# EAGLE design controller (EAGLE 7.2.0)
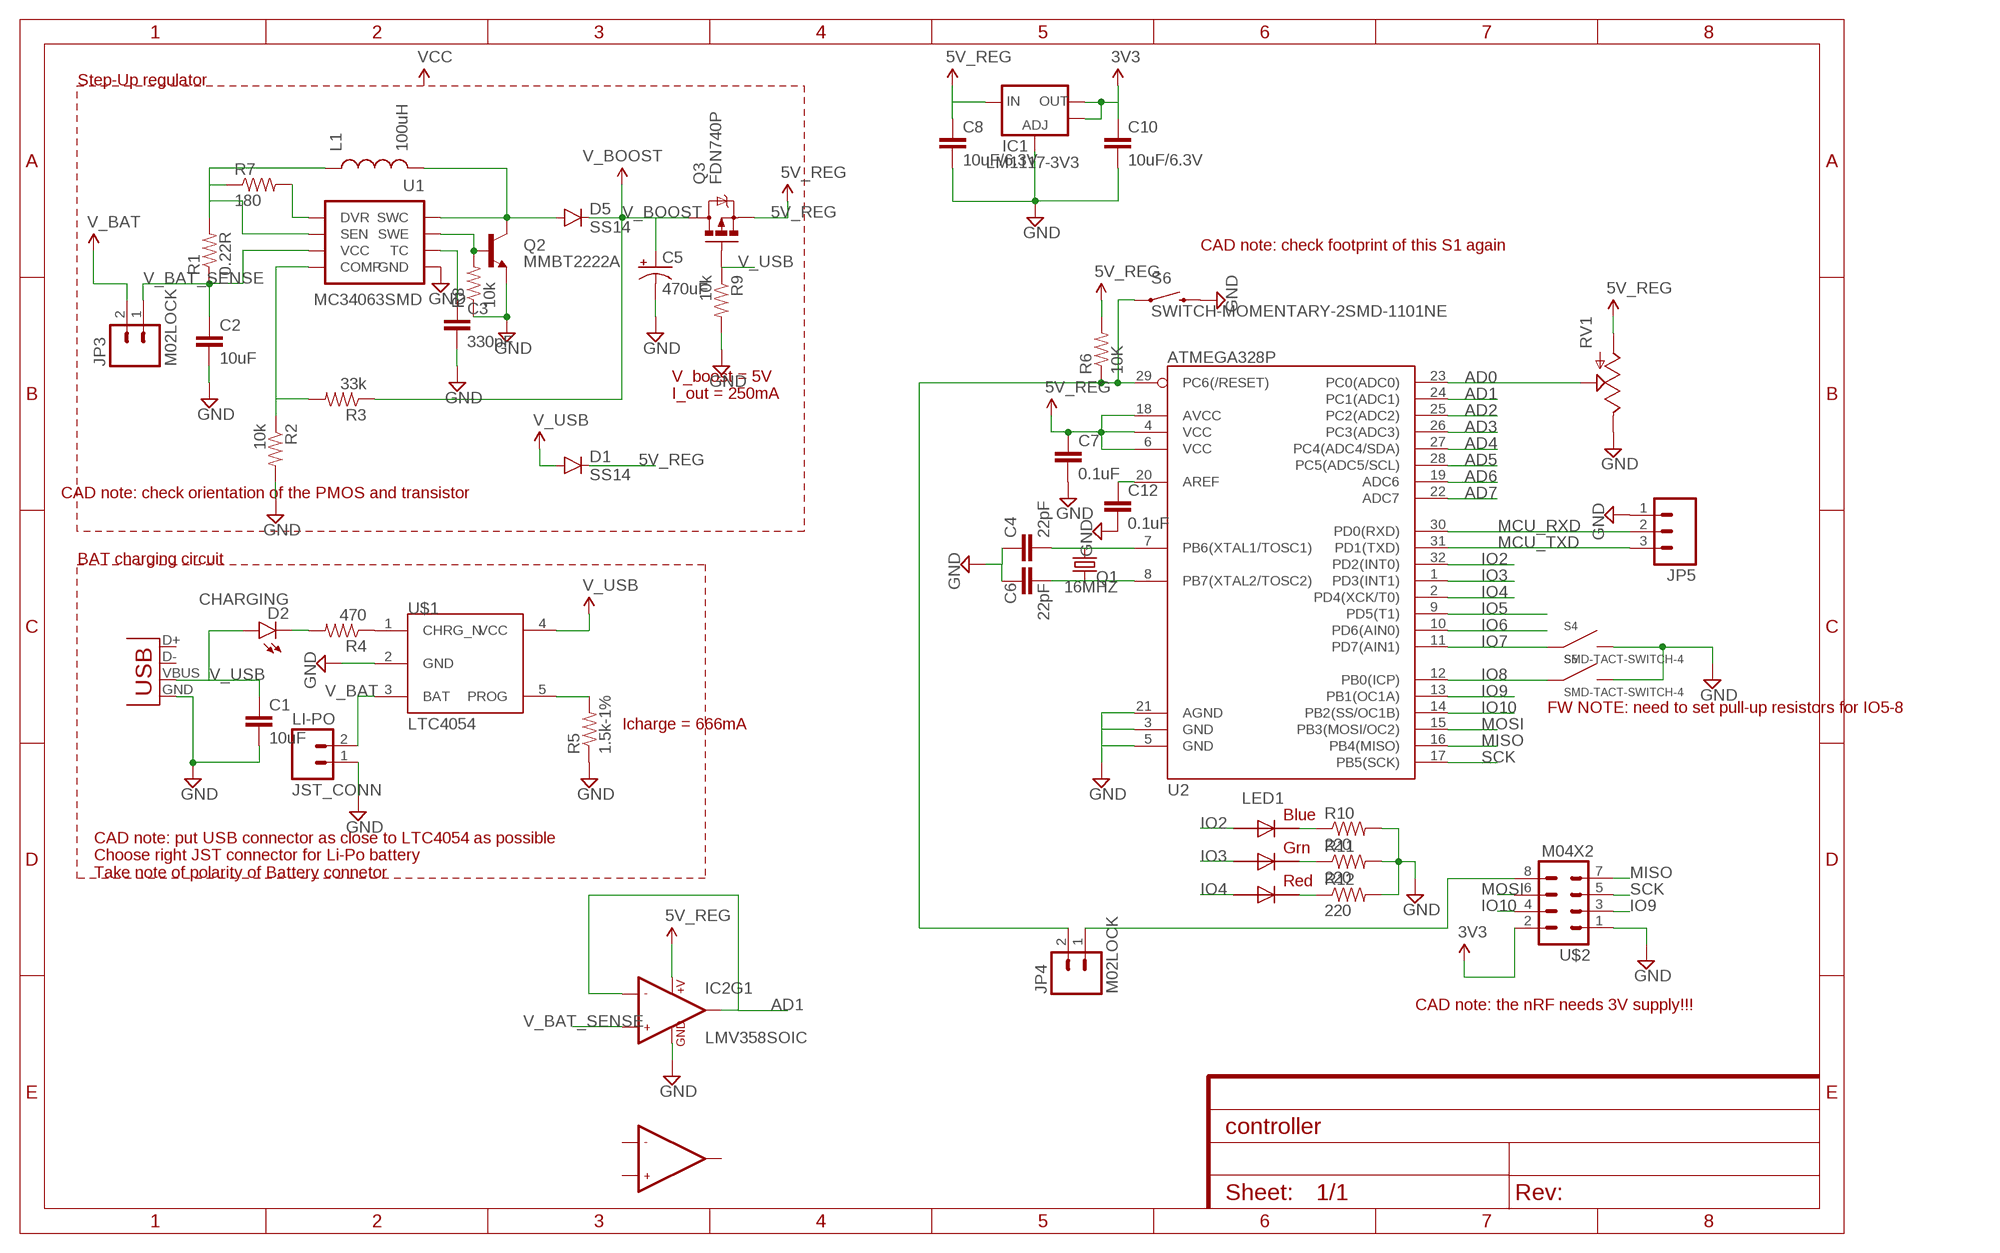
[diagram p0: schematic, sheet 1]

## Parts
C1  10uF  1.0UF-16V-10%(0603)  [0603-CAP]
C2  10uF  10UF-6.3V-20%(0603)  [0603-CAP]
C3  330pF  1.0UF-25V-+80/-20(0805)  [0805]
C4  22pF  22PF-50V-5%(0603)  [0603-CAP]
C5  470uF  100UF-10V-10%(TANT)  [EIA7343]
C6  22pF  22PF-50V-5%(0603)  [0603-CAP]
C7  0.1uF  0.1UF-25V(+80/-20%)(0603)  [0603-CAP]
C8  10uF/6.3V  10UF-6.3V-20%(0603)  [0603-CAP]
C10  10uF/6.3V  10UF-6.3V-20%(0603)  [0603-CAP]
C12  0.1uF  0.1UF-25V(+80/-20%)(0603)  [0603-CAP]
D1  SS14  DIODESMA-ALT  [SMA-DIODE_ALT]
D2  CHARGING  LED-GREEN0603  [LED-0603]
D5  SS14  DIODESMA-ALT  [SMA-DIODE_ALT]
IC1  LM1117-3V3  V_REG_LM1117SOT223  [SOT223]
IC2  LMV358SOIC  [SO08]
JP1  USB-SMD-NS  [USB-MINIB-NOSTOP]
JP3  M02LOCK  [1X02_LOCK]
JP4  M02LOCK  [1X02_LOCK]
JP5  M03LOCK  [1X03_LOCK]
L1  100uH  INDUCTORBOURNS_SRN6045  [SRN6045]
LED1  RGBLED5050  [RGBLED5050]
LI-PO  JST_CONN  M02JST-PTH-VERT  [JST-2-PTH-VERT]
Q1  16MHZ  CRYSTALHC49S  [HC49/S]
Q2  MMBT2222A  TRANSISTOR_NPNMMBT2222A  [SOT23-3]
Q3  FDN740P  MOSFET-PCHANNEL  [SOT23-3]
R1  0.22R  0.22OHM-1/4W-1%(0805)  [0805]
R2  10k  1KOHM-1/10W-1%(0603)  [0603-RES]
R3  33k  1KOHM-1/10W-1%(0603)  [0603-RES]
R4  470  470OHM1/10W1%(0603)  [0603-RES]
R5  1.5k-1%  0.22OHM-1/4W-1%(0805)  [0805]
R6  10K  10KOHM-1/10W-1%(0603)0603  [0603-RES]
R7  180  RESISTOR0603  [0603-RES]
R8  10k  RESISTOR0603  [0603-RES]
R9  10k  RESISTOR0603  [0603-RES]
R10  220  RESISTOR0603  [0603-RES]
R11  220  RESISTOR0603  [0603-RES]
R12  220  RESISTOR0603  [0603-RES]
RV1  POT-RV16AF-20  [POT_ALPHA_RV16AF-20]
S4  SMD-TACT-SWITCH-4  [SMD-TACTSWITCH-6X6X3]
S5  SMD-TACT-SWITCH-4  [SMD-TACTSWITCH-6X6X3]
S6  SWITCH-MOMENTARY-2SMD-1101NE  [TACTILE-SWITCH-1101NE]
U1  MC34063SMD  [SO08]
U2  ATMEGA328P  ATMEGA328_SMT  [TQFP32-08]
U$1  LTC4054  [SOT23-5]
U$2  M04X2  [2X4]

## Nets
3V3: C10.1 IC1.2(OUT) IC1.4(OUT) U$2.2
5V_REG: C7.1 C8.1 D1.C IC1.3(IN) IC2.8(+V) Q3.2(S) R6.2 RV1.1(A) U2.4(VCC) U2.6(VCC) U2.18(AVCC)
AD0: RV1.2(S) U2.23(PC0(ADC0))
AD1: IC2.1(OUT1) IC2.2(-IN1) U2.24(PC1(ADC1))
AD2: U2.25(PC2(ADC2))
AD3: U2.26(PC3(ADC3))
AD4: U2.27(PC4(ADC4/SDA))
AD5: U2.28(PC5(ADC5/SCL))
AD6: U2.19(ADC6)
AD7: U2.22(ADC7)
GND: C1.2 C2.2 C3.2 C4.1 C5.C(-) C6.1 C7.2 C8.2 C10.2 C12.2 IC1.1(ADJ) IC2.4(GND) JP1.GND JP5.1 LI-PO.1 Q2.2(E) R2.2 R5.1 R8.1 R9.2 R10.2 R11.2 R12.2 RV1.3(E) S4.P$2 S5.P$2 S6.2 U1.4(GND) U2.3(GND) U2.5(GND) U2.21(AGND) U$1.2(GND) U$2.1
IO2: LED1.3(BLUE_A) U2.32(PD2(INT0))
IO3: LED1.1(GREEN_A) U2.1(PD3(INT1))
IO4: LED1.2(RED_A) U2.2(PD4(XCK/T0))
IO5: U2.9(PD5(T1))
IO6: U2.10(PD6(AIN0))
IO7: S4.P$1 U2.11(PD7(AIN1))
IO8: S5.P$1 U2.12(PB0(ICP))
IO9: U2.13(PB1(OC1A)) U$2.3
IO10: U2.14(PB2(SS/OC1B)) U$2.4
MCU_RXD: JP5.2 U2.30(PD0(RXD))
MCU_TXD: JP5.3 U2.31(PD1(TXD))
MISO: U2.16(PB4(MISO)) U$2.7
MOSI: U2.15(PB3(MOSI/OC2)) U$2.6
N$3: C4.2 Q1.2 U2.7(PB6(XTAL1/TOSC1))
N$4: R5.2 U$1.5(PROG)
N$5: Q2.1(B) R8.2 U1.2(SWE)
N$6: R2.1 R3.2 U1.5(COMP)
N$7: C6.2 Q1.1 U2.8(PB7(XTAL2/TOSC2))
N$8: JP4.2 R6.1 S6.1 U2.29(PC6(/RESET))
N$9: D2.C R4.2
N$10: R4.1 U$1.1(CHRG_N)
N$11: R7.2 U1.8(DVR)
N$13: C3.1 U1.3(TC)
N$14: LED1.4(BLUE_C) R10.1
N$15: C12.1 U2.20(AREF)
N$16: LED1.6(GREEN_C) R11.1
N$17: LED1.5(RED_C) R12.1
N$21: JP4.1 U$2.8
PWR_L1: L1.1 R1.2 R7.1 U1.7(SEN)
PWR_L2: D5.A L1.2 Q2.3(C) U1.1(SWC)
SCK: U2.17(PB5(SCK)) U$2.5
V_BAT: JP3.2 LI-PO.2 U$1.3(BAT)
V_BAT_SENSE: C2.1 IC2.3(+IN1) JP3.1 R1.1 U1.6(VCC)
V_BOOST: C5.A(+) D5.C Q3.3(D) R3.1
V_USB: C1.1 D1.A D2.A JP1.VBUS Q3.1(G) R9.1 U$1.4(VCC)
Unconnected: IC2.5(+IN2) IC2.6(-IN2) IC2.7(OUT2) JP1.D+ JP1.D-

## Notes on the sheet
- Step-Up regulator
- CAD note: check footprint of this S1 again
- V_boost = 5V
  I_out = 250mA
- CAD note: check orientation of the PMOS and transistor
- BAT charging circuit
- FW NOTE: need to set pull-up resistors for IO5-8
- Icharge = 666mA
- CAD note: put USB connector as close to LTC4054 as possible
  Choose right JST connector for Li-Po battery
  Take note of polarity of Battery connetor
- CAD note: the nRF needs 3V supply!!!

## Library data of the parts
C1 = SparkFun-Capacitors:1.0UF-16V-10%(0603): CAP-00868; PROD_ID: CAP-00868; VALUE: 1.0uF
C2 = SparkFun-Capacitors:10UF-6.3V-20%(0603): CAP-11015; PROD_ID: CAP-11015
C3 = SparkFun-Capacitors:1.0UF-25V-+80/-20(0805): CAP-11625; PKG: 0603; PROD_ID: CAP-11625; VALUE: 1.0uF
C4 = SparkFun-Capacitors:22PF-50V-5%(0603): CAP-07876; PKG: 0603; PROD_ID: CAP-07876; SOURCE: http://thegioiic.com/products/0603-22pf-50v-cap
C5 = SparkFun-Capacitors:100UF-10V-10%(TANT): CAP-07890; PROD_ID: CAP-07890; VALUE: 100uF
C6 = SparkFun-Capacitors:22PF-50V-5%(0603): CAP-07876; PROD_ID: CAP-07876
C7 C12 = SparkFun-Capacitors:0.1UF-25V(+80/-20%)(0603): CAP-00810 Ceramic Standard decoupling cap; PKG: 0603; PROD_ID: CAP-00810
C8 C10 = SparkFun-Capacitors:10UF-6.3V-20%(0603): CAP-11015; PKG: 0603; PROD_ID: CAP-11015; VALUE: 10uF
D1 D5 = SparkFun-DiscreteSemi:DIODE: Diode These are standard reverse protection diodes and small signal diodes. SMA package can handle up to about 1A. SOD-323 can handle about 200mA. What the SOD-323 package when ordering, there are some mfgs out there that are 5-pin packages.; SOURCE: http://tme.vn/Product.aspx?id=639#page=pro_info
D2 = SparkFun-LED:LED-GREEN: Various green LEDs Green LEDs used in SFE Production 0603- DIO-00821 LARGE- DIO-00862 LILYPAD- DIO-09910; PROD_ID: DIO-00821; VALUE: GREEN
IC1 = SparkFun-PowerIC:V_REG_LM1117: Voltage Regulator LM1117 Standard adjustable voltage regulator but in SMD form. Spark Fun Electronics SKU : COM-00595; PROD_ID: VREG-08170; SOURCE: http://thegioiic.com/products/ld1117s33ctr
IC2 = SparkFun-AnalogIC:LMV358: Jellybean rail-to-rail output op-amp; PROD_ID: IC-09657
JP1 = SparkFun-Connectors:USB: USB Connectors USB-B-PTH is fully proven SKU : PRT-00139/CONN-08278 USB-miniB is fully proven SKU : PRT-00587 USB-A-PCB is untested. USB-A-H is throughly reviewed, but untested. Spark Fun Electronics SKU : PRT-00437 USB-B-SMT is throughly reviewed, but untested. Needs silkscreen touching up. USB-A-S has not been used/tested USB-MB-H has not been used/tested USB-MICROB has been used. CONN-09505
JP3 JP4 LI-PO = SparkFun-Connectors:M02: Standard 2-pin 0.1" header. Use with - straight break away headers ( PRT-00116) - right angle break away headers (PRT-00553) - swiss pins (PRT-00743) - machine pins (PRT-00117) - female headers (PRT-00115) Molex polarized connector foot print use with: PRT-08233 with associated crimp pins and housings. 2.54_SCREWTERM for use with PRT-10571. 3.5mm Screw Terminal footprints for PRT-08084 5mm Screw Terminal footprints for use with PRT-08432
JP5 = SparkFun-Connectors:M03: Header 3 Standard 3-pin 0.1" header. Use with straight break away headers (SKU : PRT-00116), right angle break away headers (PRT-00553), swiss pins (PRT-00743), machine pins (PRT-00117), and female headers (PRT-00115). Molex polarized connector foot print use with SKU : PRT-08232 with associated crimp pins and housings.
L1 = SparkFun-Passives:INDUCTOR: Inductors Basic Inductor/Choke - 0603 and 1206. Footprints are not proven and vary greatly between part numbers. SRN6045- 33uH, 20% 1.4A SDR0403-560KL - 56uH, 10%, 500mA RMS/740mA peak; PROD_ID: NDUC-11627; SOURCE: http://tme.vn/Product.aspx?id=1785#page=pro_info; VALUE: 33uH
LED1 = adafruit:RGBLED: For 5050 RGB LEDs, the order of the LEDs may vary from one manufacturer to another!; SOURCE: http://tme.vn/Product.aspx?id=641#page=pro_info
Q1 = adafruit:CRYSTAL: CRYSTAL; OC_FARNELL: 1667008; OC_NEWARK: unknown; SOURCE: http://thegioiic.com/products/16mhz-crystal-hc49-dip
Q2 = SparkFun-DiscreteSemi:TRANSISTOR_NPN: Generic NPN BJT MMBT2222A - TRANS-08049 (SOT-23, 1A 40V) MPSA42 - TRANS-09116 (SOT-23, 500mA 300V) MMBT5088LT1G - TRANS-11160 (SOT-23, 50 mA 30V) BC547 - COM-08928 <http://www.sparkfun.com/products/8928> (TO-92 45V 100mA) (1.Collector 2.Base 3.Emitter) 2N3904 - COM-00521 <http://www.sparkfun.com/products/521> (TO-92 40V 200mA) (1.Emitter 2.Base 3.Collector) P2N2222A - COM-12852 <http://www.sparkfun.com/products/12852> (TO-92 40V 600mA) (1.Collector 2.Base 3.Emitter); PROD_ID: TRANS-08049
Q3 = SparkFun-DiscreteSemi:MOSFET-PCHANNEL: Generic PMOSFET IRLML2244 - TRANS-11153 (SOT-23 -20V -4.3A) (1.Gate 2.Source 3.Drain) FQP27P06 - COM-10349 <http://www.sparkfun.com/products/10349> (TO-220 -60V -27A) (1.Gate 2.Source 3.Drain); PROD_ID: TRANS-08285
R1 = SparkFun-Resistors:0.22OHM-1/4W-1%(0805): RES-09883; PKG: 0805; PROD_ID: RES-09883; SOURCE: http://thegioiic.com/products/0-22r-0805-5; VALUE: 0.22
R2 R3 = SparkFun-Resistors:1KOHM-1/10W-1%(0603): RES-07856; PKG: 0603; PROD_ID: RES-07856; VALUE: 1K
R4 = SparkFun-Resistors:470OHM1/10W1%(0603): RES-07869; PKG: 0603; PROD_ID: RES-07869
R5 = SparkFun-Resistors:0.22OHM-1/4W-1%(0805): RES-09883; PKG: 0603; PROD_ID: RES-09883; SOURCE: http://thegioiic.com/products/1-5k-0603-1; VALUE: 0.22
R6 = SparkFun-Resistors:10KOHM-1/10W-1%(0603): RES-00824; PROD_ID: RES-00824
R7 = SparkFun-Resistors:RESISTOR: Resistor Basic schematic elements and footprints for 0603, 1206, and PTH resistors.; PKG: 0603; SOURCE: http://tme.vn/Product.aspx?id=1672#page=pro_info
R8 R10-R12 = SparkFun-Resistors:RESISTOR: Resistor Basic schematic elements and footprints for 0603, 1206, and PTH resistors.; PKG: 0603
R9 = SparkFun-Resistors:RESISTOR: Resistor Basic schematic elements and footprints for 0603, 1206, and PTH resistors.
RV1 = SparkFun-Electromechanical:POT
S4 S5 = Misc:SMD-TACT-SWITCH-4: Available at thegioiic and tme: http://thegioiic.com/products/tact-switch-a06; SOURCE: http://thegioiic.com/products/tact-switch-a06
S6 = SparkFun-Electromechanical:SWITCH-MOMENTARY-2: Various NO switches- pushbuttons, reed, etc; PROD_ID: SWCH-00815
U1 = SparkFun-PowerIC:MC34063: Jellybean switching supply controller
U2 = SparkFun-DigitalIC:ATMEGA328_SMT: 32-Pin Atmega328 part Commonly used on Arduino compatible boards Available in QFP and QFN packages TQFP is IC-09069 QFN is non-stock; PROD_ID: IC-09069
U$1 = PowerManagement:LTC4054
U$2 = SparkFun-Connectors:M04X2: .1" header, two rows of four.

## Board
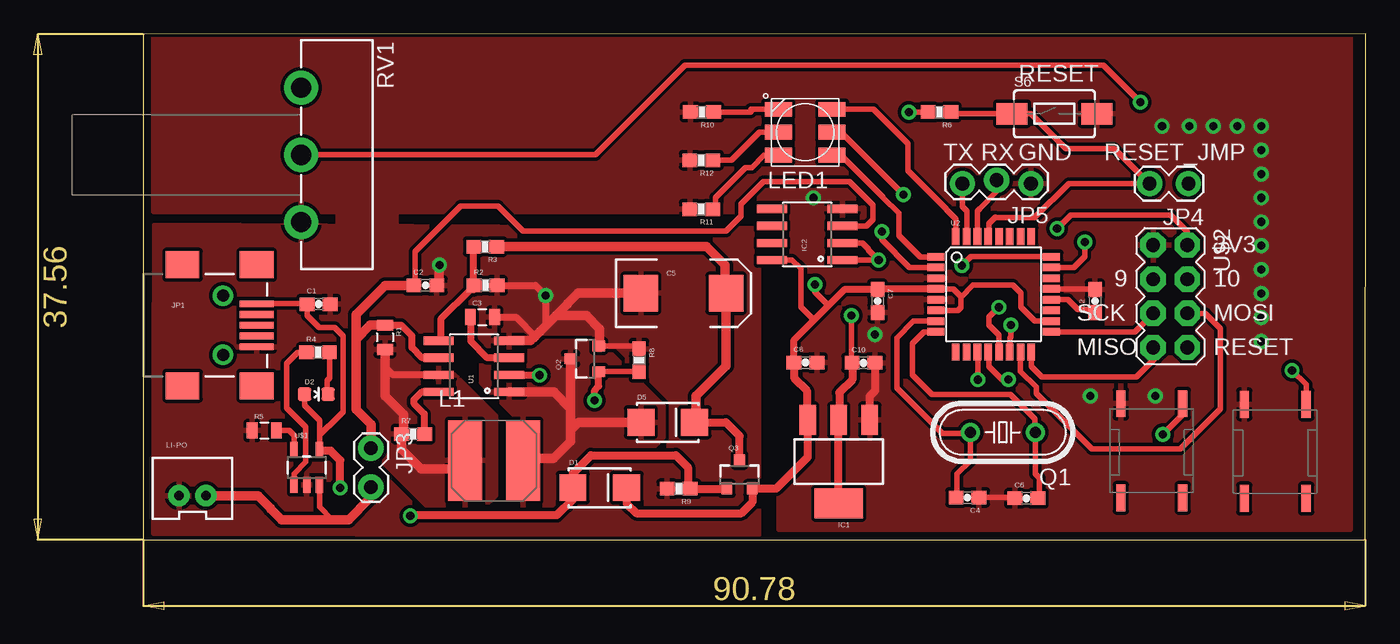
[diagram p1: board, top side]
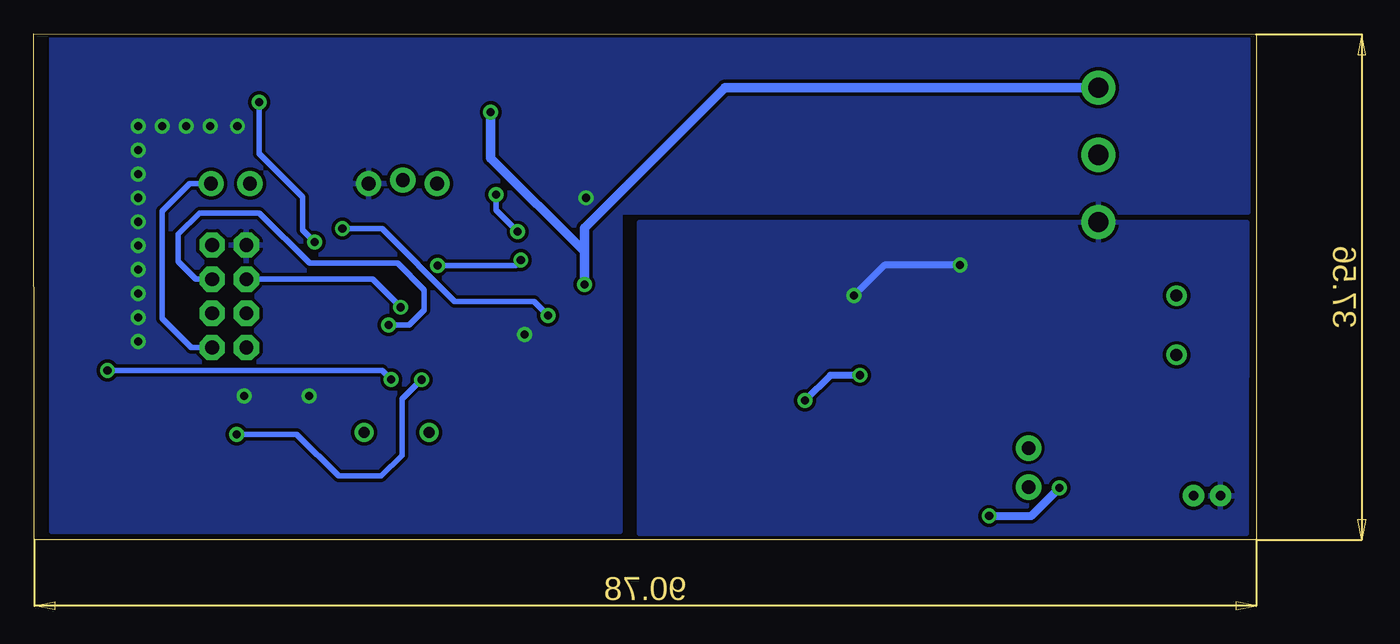
[diagram p2: board, bottom side, seen from below]

Size 90.83 x 37.61 mm. Coordinates in mm from the lower left corner, seen from the top.
Outline: 0,0 90.78,0 90.83,37.61 0,37.56 0,0
Copper layers (1*16): Top 0.035mm / dielectric 1.5mm / Bottom 0.035mm
Design rules "SparkFun": minimum track width 8mil, minimum drill 20mil, track to track 8mil, track to pad 8mil, pad to pad 8mil, via to via 8mil, smd to smd 8mil, copper to edge 10mil, drill to drill 8mil, minimum pad ring 12mil, minimum via ring 10mil, stop-mask expansion 4mil, vias tented up to drill 25mil, thermal gap 10mil

### Footprints (pad centres in the part's own frame; a part is rotated, then mirrored left to right if it is on the bottom)
0603-CAP = smd 1.1 x 1: 1 -0.85,0; 2 0.85,0
0805 = smd 0.8 x 1.2: 1 -0.9,0; 2 0.9,0
EIA7343 = smd 2.55 x 2.7: A 3.17,0; C -3.17,0
SMA-DIODE_ALT = smd 2 x 2: A -2,0; C 2,0
LED-0603 = smd 1 x 1: A 0,-0.877; C 0,0.877
SOT223 = smd 1.219 x 2.235: 1 -2.311,-3.099; 2 0,-3.099; 3 2.311,-3.099 | smd 3.6 x 2.2: 4 0,3.099
SO08 = smd 0.61 x 2.21: 1 -1.905,-2.616; 2 -0.635,-2.616; 3 0.635,-2.616; 4 1.905,-2.616; 5 1.905,2.616; 6 0.635,2.616; 7 -0.635,2.616; 8 -1.905,2.616
USB-MINIB-NOSTOP = smd 2.5 x 0.5: D+ 2.5,0; D- 2.5,0.8; GND 2.5,-1.6; ID 2.5,-0.8; VBUS 2.5,1.6 | smd 2.5 x 2: G1 -3,-4.5; G2 -3,4.5; G3 2.5,4.5; G4 2.5,-4.5 | drill 0.9 pad 0.8: H1 0,2.2 | drill 0.9 pad 0.787: H2 0,-2.2
1X02_LOCK = drill 1.016 pad 1.88: 1 -0.178,0; 2 2.718,0
1X03_LOCK = drill 1.016 pad 1.88: 1 0,0.127; 2 2.54,-0.127; 3 5.08,0.127
SRN6045 = smd 2.5 x 6: 1 -2.175,-0.175; 2 2.125,-0.175
RGBLED5050 = smd 2 x 1.1: 1 -2,1.7; 2 -2,0; 3 -2,-1.7; 4 2,-1.7; 5 2,0; 6 2,1.7
JST-2-PTH-VERT = drill 0.7 pad 1.6: 1 -1,-0.55; 2 1,-0.55
HC49/S = drill 0.813: 1 -2.413,0; 2 2.413,0
SOT23-3 = smd 0.8 x 0.9: 1 -0.95,-1; 2 0.95,-1; 3 0,1.1
0603-RES = smd 1.1 x 1: 1 -0.85,0; 2 0.85,0
POT_ALPHA_RV16AF-20 = drill 1.5 pad 2.54: 1 -5,0; 2 0,0; 3 5,0
SMD-TACTSWITCH-6X6X3 = smd 2 x 0.7: P$1 -0.4,-0.8; P$2 -0.4,-5.4; P$3 6.6,-0.8; P$4 6.6,-5.4
TACTILE-SWITCH-1101NE = smd 2.3 x 1.6: 1 -3.15,0; 2 3.15,0
TQFP32-08 = smd 1.27 x 0.559: 1 -4.293,2.8; 2 -4.293,2; 3 -4.293,1.2; 4 -4.293,0.4; 5 -4.293,-0.4; 6 -4.293,-1.2; 7 -4.293,-2; 8 -4.293,-2.8; 17 4.293,-2.8; 18 4.293,-2; 19 4.293,-1.2; 20 4.293,-0.4; 21 4.293,0.4; 22 4.293,1.2; 23 4.293,2; 24 4.293,2.8 | smd 0.559 x 1.27: 9 -2.8,-4.293; 10 -2,-4.293; 11 -1.2,-4.293; 12 -0.4,-4.293; 13 0.4,-4.293; 14 1.2,-4.293; 15 2,-4.293; 16 2.8,-4.293; 25 2.8,4.293; 26 2,4.293; 27 1.2,4.293; 28 0.4,4.293; 29 -0.4,4.293; 30 -1.2,4.293; 31 -2,4.293; 32 -2.8,4.293
SOT23-5 = smd 0.55 x 1.2: 1 -0.95,-1.3; 2 0,-1.3; 3 0.95,-1.3; 4 0.95,1.3; 5 -0.95,1.3
2X4 = drill 1.016 pad 1.88 octagon: 1 -3.81,-1.27; 2 -3.81,1.27; 3 -1.27,-1.27; 4 -1.27,1.27; 5 1.27,-1.27; 6 1.27,1.27; 7 3.81,-1.27; 8 3.81,1.27

### Placement (x,y rotation side)
C1  13.03,17.5 0 top
C2  20.95,18.9 0 top
C3  25.2,16.54 0 top
C4  61.24,3.12 180 top
C5  40.13,18.31 0 top
C6  65.61,3.07 0 top
C7  54.56,17.73 270 top
C8  49.2,13.16 0 top
C10  53.52,13.13 0 top
C12  70.71,17.73 90 top
D1  33.91,3.86 0 top
D2  12.85,10.81 270 top
D5  38.96,8.71 0 top
IC1  51.66,5.79 180 top
IC2  49.33,22.68 90 top
JP1  5.92,15.93 0 top
JP3  16.92,6.63 270 top
JP4  77.47,26.47 180 top
JP5  65.94,26.59 180 top
L1  26.09,6.05 0 top
LED1  49.17,30.28 180 top
LI-PO  3.65,3.81 0 top
Q1  63.86,7.98 180 top
Q2  32.84,13.44 90 top
Q3  44.3,4.8 0 top
R1  17.96,15.04 270 top
R2  25.43,18.9 0 top
R3  25.4,21.77 180 top
R4  12.98,13.92 0 top
R5  8.99,8.1 0 top
R6  59.16,31.78 180 top
R7  20.04,7.85 0 top
R8  36.83,13.34 270 top
R9  39.78,3.78 180 top
R10  41.5,31.78 180 top
R11  41.45,24.56 180 top
R12  41.45,28.19 180 top
RV1  11.73,28.6 270 top
S4  78.03,9.7 270 top
S5  87.2,9.65 270 top
S6  67.69,31.65 0 top
U1  24.56,12.88 90 top
U2  63.17,18.24 0 top
U$1  12.14,5.36 0 top
U$2  76.3,18.08 270 top

### Tracks (layer width: path | path; a pad name or v marks a point on that pad's centre or on a via)
3V3  (via drill 0.6)
  Top 0.406: U$2.2 77.57,22.89 76.33,24.13 68.91,24.13 v67.89,23.11 | v52.6,16.66 52.6,13.2 C10.1
  Top 0.61: IC1.4 51.66,8.38 | 51.66,8.38 IC1.2 | C10.1 52.67,11.88 51.71,10.92 51.71,8.43 51.66,8.38
  Bottom 0.406: v52.6,16.66 53.65,17.7 59.54,17.7 64.95,23.11 v67.89,23.11
5V_REG  (via drill 0.6)
  Top 0.406: U2.4 60.18,18.64 60.73,18.09 60.73,18.01 | 60.73,18.01 60.73,17.25 60.53,17.04 U2.6 | U2.18 66.24,16.24 65.2,17.27 65.2,18.31 64.59,18.92 61.65,18.92 60.73,18.01 | v49.91,18.97 49.91,18.41 50.91,17.41 | IC2.8 48.21,20.78 48.84,20.14 48.84,17.3 49.82,16.32 | R6.2 v56.87,31.77
  Top 0.508: U2.4 54.62,18.64 C7.1 52.08,18.58 50.91,17.41 49.82,16.32 48.35,14.85 C8.1
  Top 0.61: D1.C 35.91,2.67 36.63,1.96 44.42,1.96 45.25,2.78 Q3.2 47.03,3.8 49.35,6.12 49.35,8.38 | IC1.3 49.35,8.38 | C8.1 48.35,12.03 49.3,11.07 49.3,8.43 49.35,8.38
  Bottom 0.711: 49.91,21.41 49.91,23.14 39.45,33.6 RV1.1 | 49.91,21.41 v49.91,18.97 | v56.87,31.77 56.87,28.37 49.91,21.41
AD0  (via drill 0.6)
  Top 0.406: RV1.2 33.6,28.6 40.26,35.26 71.32,35.26 v74.07,32.51 | v69.95,22.12 69.95,21.06 69.13,20.24 U2.23
  Bottom 0.406: v74.07,32.51 74.07,28.68 70.84,25.45 70.84,23.01 v69.95,22.12
AD1  (via drill 0.6)
  Top 0.406: U2.24 61.5,21.04 v60.83,20.37 | IC2.1 v54.63,20.78 53.87,21.54 53.87,21.59 53.42,22.05 IC2.2
  Bottom 0.406: v60.83,20.37 55.04,20.37 v54.63,20.78
GND  (via drill 0.6)
  Top 0.406: R8.1 36.63,14.39 Q2.2 33.91,14.45 | 28.98,14.99 28.78,14.78 | C4.1 64.71,3.12 C6.1 | U2.21 70.66,18.64 C12.2
  Top 0.508: 21.98,20.38 v22,20.4 | 29.48,15.48 29.9,15.9 v29.9,18.14 29.13,18.9 R2.2 | C3.2 27.69,16.54 29.11,15.11
  Top 0.61: C10.2 54.37,11.06 53.95,10.64 53.95,8.91 IC1.1
  Top 0.711: U1.4 28.78,14.78 | 28.98,14.99 29.11,15.11 29.48,15.48 30.66,16.66 | 30.66,16.66 32.92,16.66 33.91,15.67 33.91,14.45 | 30.66,16.66 31.52,17.53 31.52,17.55 32.28,18.31 C5.C | 21.98,20.38 21.98,19.07 C2.2
  Bottom 0.508: v22,20.4 27.64,20.4 v29.9,18.14
  other vias: 83.06,14.73 83.06,16.51 83.06,18.29 83.06,20.07 83.06,21.84 83.06,23.62 83.06,25.4 83.06,27.18 83.06,28.96 83.06,30.73 81.28,30.73 79.5,30.73 77.72,30.73 75.69,30.73 75.18,10.67 70.36,10.67 54.36,15.24 49.78,25.4
  pour Top (isolate 0.254, rank 6): 45.72,23.11 45.72,0.36 0.79,0.46 0.84,23.39
  pour Bottom (isolate 0.254, rank 6): 0.71,23.55 45.82,23.55 45.82,0.48 0.74,0.48
  pour Bottom (isolate 0.254, rank 6): 0.71,37.24 89.48,37.24 89.48,0.61 47.27,0.61 47.27,24.33 0.61,24.33 0.61,37.19
  pour Top (isolate 0.254, rank 6): 89.66,0.76 89.66,37.34 0.76,37.34 0.76,24.38 14.48,24.38 14.48,20.57 18.8,20.57 18.8,24.38 47.24,24.38 47.24,0.76
IO2
  Top 0.406: U2.32 60.37,23.83 59.66,24.54 59.66,24.56 56.79,27.43 56.79,29.41 54.23,31.98 LED1.3
IO3
  Top 0.406: LED1.1 51.84,28.58 54.97,25.45 54.97,25.43 56.13,24.26 56.13,22.61 57.73,21.01 58.85,21.01 U2.1
IO4  (via drill 0.6)
  Top 0.406: LED1.2 51.84,30.28 v56.46,25.65 | v54.86,22.89 54.86,22.3 56.93,20.24 U2.2
  Bottom 0.406: v56.46,25.65 56.46,24.49 v54.86,22.89
IO7  (via drill 0.6)
  Top 0.406: S4.P$1 77.23,9.31 v75.74,7.82 | 61.97,11.92 v62,11.89 62,13.91 U2.11
  Bottom 0.406: v75.74,7.82 71.27,7.82 68.17,4.72 65,4.72 63.45,6.27 63.45,10.44 v62,11.89
IO8  (via drill 0.6)
  Top 0.406: S5.P$1 86.4,11.52 v85.34,12.57 | v64.26,11.91 63.78,11.91 62.81,12.88 62.81,13.9 U2.12
  Bottom 0.406: v85.34,12.57 64.92,12.57 v64.26,11.91
IO9  (via drill 0.6)
  Top 0.406: v63.58,17.27 62.84,16.54 62.84,15.95 63.58,15.21 63.58,13.95 U2.13
  Bottom 0.406: U$2.3 65.66,19.36 v63.58,17.27
IO10  (via drill 0.6)
  Top 0.406: v64.47,15.95 64.47,15.06 64.39,14.99 64.39,13.96 U2.14
  Bottom 0.406: U$2.4 78.79,19.36 80.09,20.65 80.09,22.71 78.51,24.28 74.07,24.28 70.33,20.55 63.8,20.55 61.82,18.57 61.82,17.07 62.94,15.95 v64.47,15.95
MCU_RXD
  Top 0.406: U2.30 61.97,24.4 62.15,24.59 62.15,24.61 63.4,25.86 JP5.2
MCU_TXD
  Top 0.406: JP5.3 60.86,24.77 61.19,24.43 61.19,22.55 U2.31
MISO
  Top 0.406: U2.16 65.97,12.87 66.75,12.09 73.79,12.09 75.16,13.46 75.16,14.15 U$2.7
MOSI
  Top 0.406: 67,10.19 67.03,10.19 | 67.03,10.19 70.46,6.76 77.06,6.76 80.03,9.73 80.03,15.7 78.92,16.82 U$2.6 | U2.15 65.17,12.5 66.34,11.33 66.34,10.87 67.03,10.19
N$3
  Top 0.406: C4.2 60.45,3.19 60.45,4.88 61.44,5.87 Q1.2 61.37,7.9 59.36,7.9 55.98,11.28 55.98,14.99 57.23,16.24 U2.7
N$4
  Top 0.406: R5.2 10.82,8.1 11.19,7.73 | 11.23,7.7 11.19,7.73 | U$1.5 11.19,7.73
N$5  (via drill 0.6)
  Top 0.406: Q2.1 R8.2
  Top 0.508: U1.2 29.41,12.24 v29.44,12.22 | v33.53,10.34 33.53,11.1 33.83,11.4 33.83,12.48 Q2.1
  Bottom 0.508: v29.44,12.22 31.65,12.22 v33.53,10.34
N$6
  Top 0.508: 24.55,18.57 R2.1 | 24.55,18.57 R3.2 | 24.55,18.57 24.28,18.57 22.1,16.38 22.1,14.94 U1.5
N$7
  Top 0.406: C6.2 66.57,3.19 66.57,4.6 66.27,4.9 Q1.1 66.24,8 66.24,8.97 64.41,10.79 58.6,10.79 57.15,12.24 57.15,14.58 58.01,15.44 U2.8
N$8
  Top 0.406: U2.29 62.81,22.57 62.81,23.5 63.3,23.98 63.35,23.93 66.22,23.93 68.76,26.47 JP4.2 72.16,29.06 68.53,29.06 65.94,31.65 S6.1 60.13,31.65 R6.1
N$9
  Top 0.406: R4.2 13.83,12 13.66,11.84 13.66,10.88 D2.C
N$10
  Top 0.406: R4.1 11.46,13.92 10.64,13.11 10.64,9.8 12.06,8.38 12.06,5.77 11.2,4.9 11.2,4.07 U$1.1
N$11
  Top 0.508: U1.8 20.68,10.97 20.09,10.39 20.09,10.13 20.88,9.35 R7.2
N$13
  Top 0.508: U1.3 25.55,13.51 24.33,14.73 24.33,16.5 C3.1
N$14
  Top 0.406: LED1.4 45.29,31.98 | 45.29,31.98 45.16,31.98 45.16,31.82 45.11,31.77 | R10.1 45.09,31.77 45.29,31.98
N$15
  Top 0.406: U2.20 68.7,17.84 69.42,17.12 70.47,17.12 C12.1
N$16
  Top 0.406: LED1.6 46.13,28.58 45.21,27.66 44.73,27.66 42.49,25.43 42.49,24.75 R11.1
N$17
  Top 0.406: LED1.5 45.8,30.28 43.71,28.19 R12.1
N$21
  Bottom 0.406: U$2.8 79.12,14.28 81.28,16.43 81.28,24.41 79.22,26.47 JP4.1
PWR_L1
  Top 0.406: 19.33,7.99 R7.1 | 24.41,5.26 24.61,5.46 24.32,5.46 L1.1
  Top 0.508: U1.7 18.54,12.24 17.96,12.83
  Top 0.711: R1.2 17.96,12.83 17.96,10.69 19.33,9.32 19.33,7.99 | R7.1 19.19,6.72 20.65,5.26 24.41,5.26
  pour Top (isolate 0.254): 16.76,14.73 16.76,10.16 16.76,6.86 21.08,2.54 25.4,2.54 26.16,3.3 26.16,9.14 20.32,14.99 16.76,14.99
PWR_L2
  Top 0.406: 28.07,6.02 27.66,6.43 27.66,6.42 L1.2
  Top 0.711: Q2.3 31.74,9.73 | 31.74,9.73 31.74,8.1 | 31.74,8.1 31.74,7.28 30.48,6.02 28.07,6.02 | U1.1 30.5,10.97 31.74,9.73 | D5.A 32.35,8.71 31.74,8.1
  pour Top (isolate 0.254): 25.4,14.73 33.78,14.73 38.61,9.91 38.61,7.62 35.05,4.06 33.02,2.03 27.69,2.03 27.69,9.14 25.15,11.68 25.15,14.73
SCK
  Top 0.406: U2.17 73.65,15.44 U$2.5
V_BAT
  Top 0.406: U$1.3 13.09,2.43 14.05,1.47 | 16.82,3.81 JP3.2
  Top 0.711: LI-PO.2 8.53,3.26 9.47,2.31 9.47,2.29 10.29,1.47 14.05,1.47 15.24,1.47 16.82,3.05 16.82,3.81
V_BAT_SENSE
  Top 0.406: IC2.3 53.72,23.32 54.2,23.8 54.2,24.87 52.45,26.62 46.08,26.62 44.4,24.94 44.4,24.05 43.28,22.94 28.22,22.94 26.36,24.79 23.57,24.79 20.19,21.41 20.19,18.99 C2.1
  Top 0.508: U1.6 20.73,13.51 19.96,14.28 19.96,15.14 19.17,15.94 R1.1
  Top 0.711: 15.8,14.88 15.8,16.74 17.96,18.9 C2.1 | 15.8,14.88 15.8,9.68 16.92,8.56 JP3.1 | R1.1 16.85,15.94 15.8,14.88
V_BOOST
  Top 0.61: D5.C 43.28,8.71 44.3,7.7 Q3.3
  Top 0.711: 41.19,8.94 D5.C 41.05,8.79 41.05,10.67 43.3,12.92 43.3,17.73 | C5.A 43.3,17.73 | R3.1 41.83,21.77 43.2,20.4 43.2,17.83 43.3,17.73
V_USB  (via drill 0.6)
  Top 0.406: JP1.VBUS 12.15,17.53 C1.1 | C1.1 11.74,17.5 | 11.86,10.92 D2.A 11.98,9.97 13.09,8.85 13.09,7.77 | U$1.4 13.09,7.77 | C1.1 12.18,16.65 13.06,15.77 14.2,15.77 14.83,15.14 14.83,9.47 13.79,8.43 13.75,8.43 13.09,7.77
  Top 0.61: Q3.1 43.33,3.79 R9.1 40.46,3.95 40.46,5.38 39.57,6.27 33.25,6.27 31.91,4.93 D1.A 31.91,3 30.71,1.8 19.89,1.8 v19.84,1.75 | v14.63,3.83 14.63,5.89 13.92,6.6 13.15,6.6 U$1.4
  Bottom 0.61: v19.84,1.75 16.71,1.75 v14.63,3.83

### Text on the board
tPlace: RESET | TX | RX | GND | RESET_JMP | 3V3 | 9 | 10 | SCK | MOSI | MISO | RESET